# Altium schematic sheet ADC.SchDoc
size 297 x 209 mm
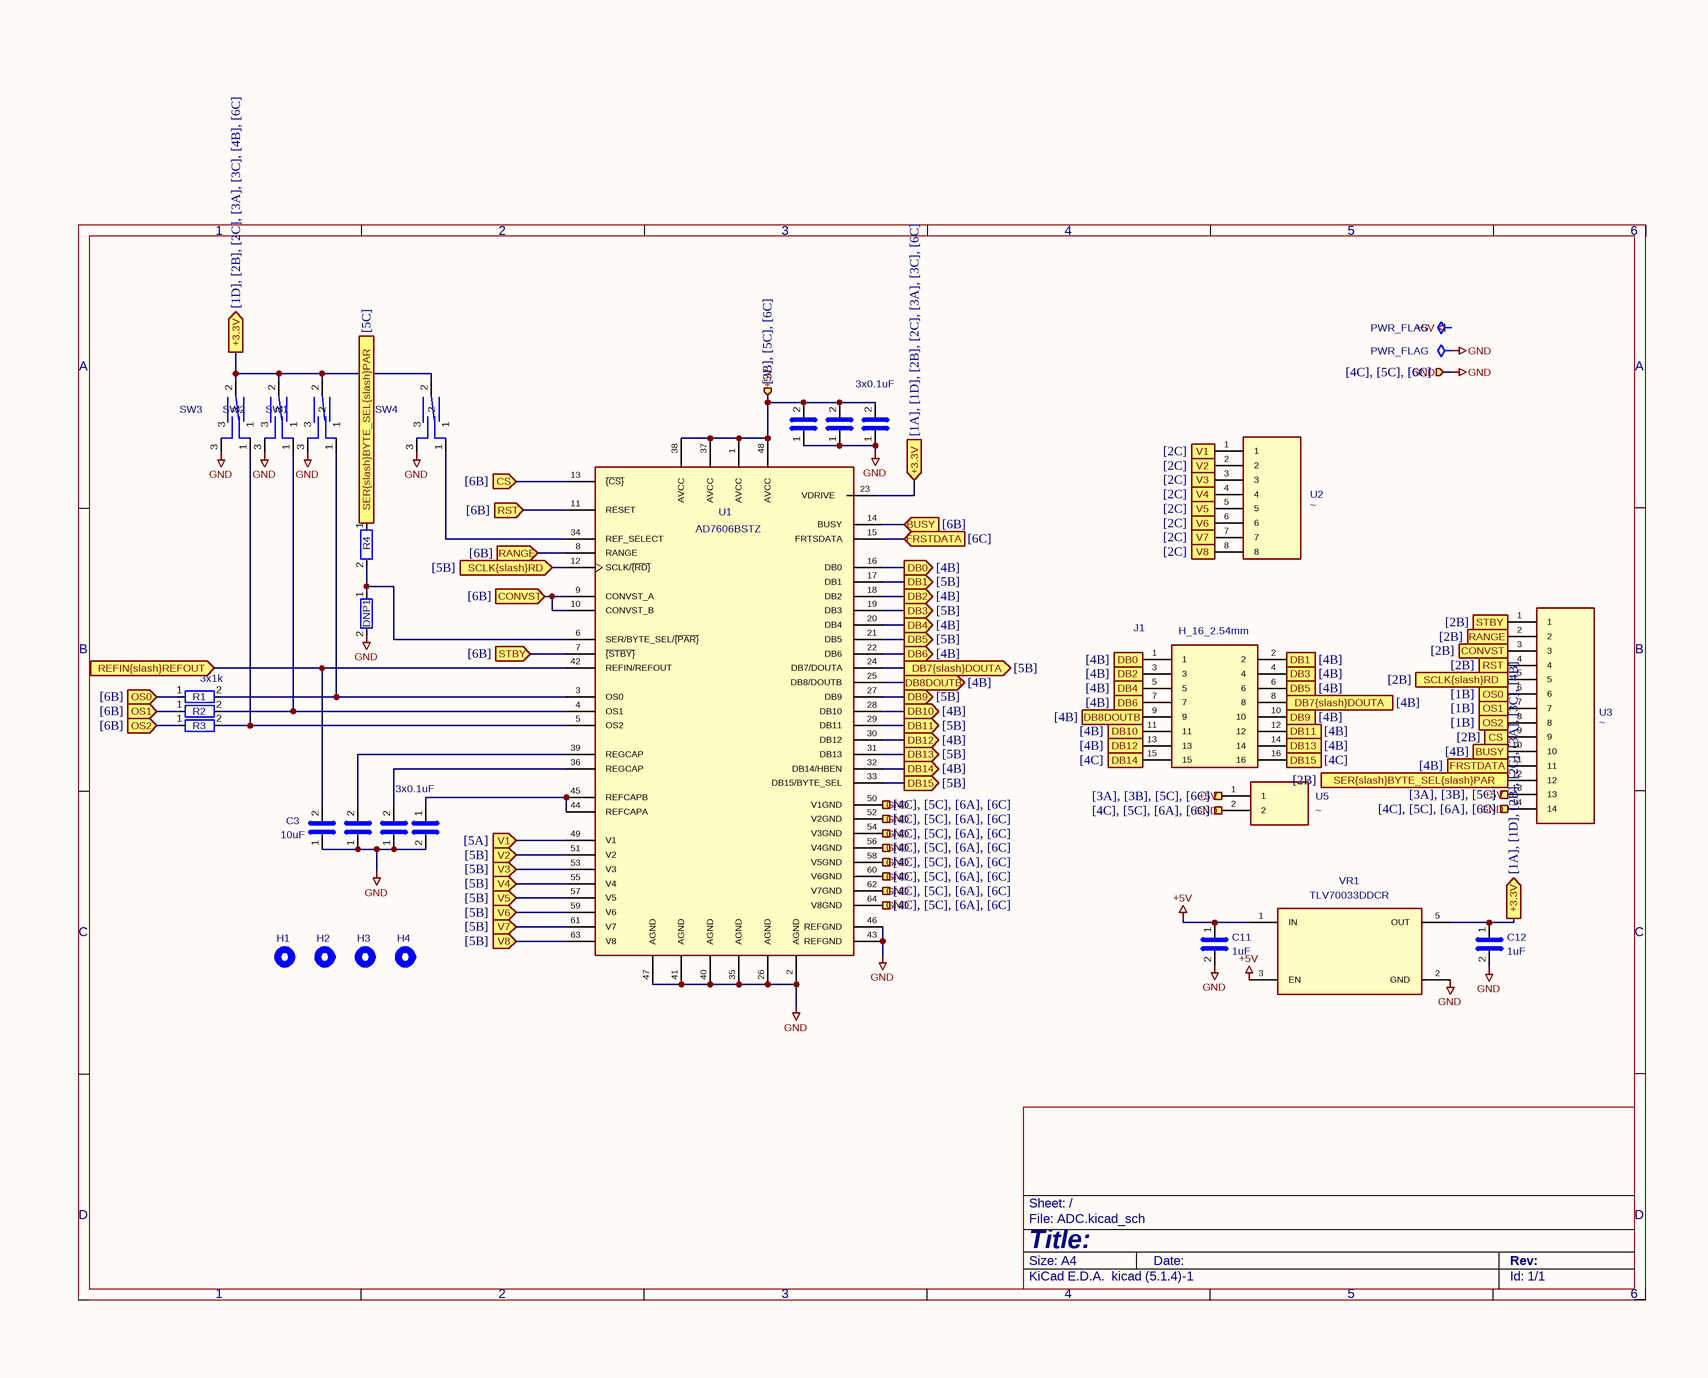
[diagram p0: ADC.SchDoc]

## Parts
#FLG02  PWR_FLAG  (graphical)
#FLG03  PWR_FLAG  (graphical)
C2  1uF  [C_0402_1005Metric_Pad0.74x0.62mm_HandSolder]  (value not drawn)
C3  10uF  [C_0805_2012Metric_Pad1.18x1.45mm_HandSolder]
C4  0.1uF  [C_0402_1005Metric_Pad0.74x0.62mm_HandSolder]  (value not drawn)
C6  1uF  [C_0402_1005Metric_Pad0.74x0.62mm_HandSolder]  (value not drawn)
C7  1uF  [C_0402_1005Metric_Pad0.74x0.62mm_HandSolder]  (value not drawn)
C8  0.1uF  [C_0402_1005Metric_Pad0.74x0.62mm_HandSolder]  (value not drawn)
C9  0.1uF  [C_0402_1005Metric_Pad0.74x0.62mm_HandSolder]  (value not drawn)
C11  1uF  [C_0402_1005Metric_Pad0.74x0.62mm_HandSolder]
C12  1uF  [C_0402_1005Metric_Pad0.74x0.62mm_HandSolder]
DNP1  10-47k  [R_0805_2012Metric_Pad1.20x1.40mm_HandSolder]  (value not drawn)
H1  MountingHole  [MountingHole_2.7mm_M2.5]  (value not drawn)
H2  MountingHole  [MountingHole_2.7mm_M2.5]  (value not drawn)
H3  MountingHole  [MountingHole_2.7mm_M2.5]  (value not drawn)
H4  MountingHole  [MountingHole_2.7mm_M2.5]  (value not drawn)
J1  H_16_2.54mm  [JST_SUR_SM16B-SURS-TF_1x16-1MP_P0.80mm_Horizontal]
R1  1k  [R_0402_1005Metric_Pad0.72x0.64mm_HandSolder]  (value not drawn)
R2  1k  [R_0402_1005Metric_Pad0.72x0.64mm_HandSolder]  (value not drawn)
R3  1k  [R_0402_1005Metric_Pad0.72x0.64mm_HandSolder]  (value not drawn)
R4  1k  [R_0805_2012Metric_Pad1.20x1.40mm_HandSolder]  (value not drawn)
SW1  SW_Reed_SPDT  [switch1]  (value not drawn)
SW2  SW_Reed_SPDT  [switch1]  (value not drawn)
SW3  SW_Reed_SPDT  [switch1]  (value not drawn)
SW4  SW_Reed_SPDT  [switch1]  (value not drawn)
U1  AD7606BSTZ  [AD7606BSTZ]
U2  ~  [JST_GH_SM08B-GHS-TB_1x08-1MP_P1.25mm_Horizontal]
U3  ~  [PinHeader_1x14_P2.54mm_Vertical]
U5  ~  [JST_GH_SM02B-GHS-TB_1x02-1MP_P1.25mm_Horizontal]
VR1  TLV70033DDCR  [TLV70033DDCR]

## Ports
+3.3V (in, see [1A], [1D], [2B], [2C], [3A], [3C], [6C]), +3.3V (out, see [1A], [1D], [2B], [2C], [3A], [3C], [4B]), +3.3V (out, see [1D], [2B], [2C], [3A], [3C], [4B], [6C]), +5V (in, see [3B], [5C], [6C]), +5V (out, see [3A], [3B], [5C]), +5V (out, see [3A], [3B], [5C], [6C]), BUSY (in, see [6B]), BUSY (out, see [4B]), CONVST (in, see [6B]), CONVST (out, see [2B]), CS (in, see [6B]), CS (out, see [2B]), DB0 (in, see [4B]), DB0 (out, see [4B]), DB1 (in, see [4B]), DB1 (out, see [5B]), DB2 (in, see [4B]), DB2 (out, see [4B]), DB3 (in, see [4B]), DB3 (out, see [5B]), DB4 (in, see [4B]), DB4 (out, see [4B]), DB5 (in, see [4B]), DB5 (out, see [5B]), DB6 (in, see [4B]), DB6 (out, see [4B]), DB7{slash}DOUTA (in, see [4B]), DB7{slash}DOUTA (out, see [5B]), DB8DOUTB (in, see [4B]), DB8DOUTB (out, see [4B]), DB9 (in, see [4B]), DB9 (out, see [5B]), DB10 (in, see [4B]), DB10 (out, see [4B]), DB11 (in, see [4B]), DB11 (out, see [5B]), DB12 (in, see [4B]), DB12 (out, see [4B]), DB13 (in, see [4B]), DB13 (out, see [5B]), DB14 (in, see [4C]), DB14 (out, see [4B]), DB15 (in, see [4C]), DB15 (out, see [5B]), FRSTDATA (in, see [6C]), FRSTDATA (out, see [4B]), GND (in, see [4C], [5C], [6A], [6C]), GND (in, see [4C], [5C], [6C]), GND (out, see [4C], [5C], [6A], [6C]), OS0 (in, see [6B]), OS0 (out, see [1B]), OS1 (in, see [6B]), OS1 (out, see [1B]), OS2 (in, see [6B]), OS2 (out, see [1B]), RANGE (in, see [6B]), RANGE (out, see [2B]), REFIN{slash}REFOUT (in), RST (in, see [6B]), RST (out, see [2B]), SCLK{slash}RD (in, see [5B]), SCLK{slash}RD (out, see [2B]), SER{slash}BYTE_SEL{slash}PAR (in, see [5C]), SER{slash}BYTE_SEL{slash}PAR (out, see [2B]), STBY (in, see [6B]), STBY (out, see [2B]), V1 (in, see [5A]), V1 (out, see [2C]), V2 (in, see [5B]), V2 (out, see [2C]), V3 (in, see [5B]), V3 (out, see [2C]), V4 (in, see [5B]), V4 (out, see [2C]), V5 (in, see [5B]), V5 (out, see [2C]), V6 (in, see [5B]), V6 (out, see [2C]), V7 (in, see [5B]), V7 (out, see [2C]), V8 (in, see [5B]), V8 (out, see [2C])

## Nets
+5V: #FLG03.1 C11.1 VR1.1(IN) VR1.3(EN)
GND: #FLG02.1 C2.1 C3.1 C4.1 C6.1 C7.2 C8.1 C9.1 C11.2 C12.2 DNP1.2 SW1.3 SW2.3 SW3.3 SW4.3 U1.2(AGND) U1.26(AGND) U1.35(AGND) U1.40(AGND) U1.41(AGND) U1.43(REFGND) U1.46(REFGND) U1.47(AGND) U1.50(V1GND) U1.52(V2GND) U1.54(V3GND) U1.56(V4GND) U1.58(V5GND) U1.60(V6GND) U1.62(V7GND) U1.64(V8GND) U3.14 U5.2 VR1.2(GND) ; port GND
+3.3V: C12.1 SW1.2 SW2.2 SW3.2 SW4.2 U1.23(VDRIVE) VR1.5(OUT) ; port +3.3V
+5V: C4.2 C8.2 C9.2 U1.1(AVCC) U1.37(AVCC) U1.38(AVCC) U1.48(AVCC) U3.13 U5.1 ; port +5V  [a separate net that carries the same name]
BUSY: U1.14(BUSY) U3.10 ; port BUSY
CONVST: U1.9(CONVST_A) U1.10(CONVST_B) U3.3 ; port CONVST
CS: U1.13(~{{CS}}) U3.9 ; port CS
DB0: J1.1 U1.16(DB0) ; port DB0
DB1: J1.2 U1.17(DB1) ; port DB1
DB2: J1.3 U1.18(DB2) ; port DB2
DB3: J1.4 U1.19(DB3) ; port DB3
DB4: J1.5 U1.20(DB4) ; port DB4
DB5: J1.6 U1.21(DB5) ; port DB5
DB6: J1.7 U1.22(DB6) ; port DB6
DB7{slash}DOUTA: J1.8 U1.24(DB7/DOUTA) ; port DB7{slash}DOUTA
DB8DOUTB: J1.9 U1.25(DB8/DOUTB) ; port DB8DOUTB
DB9: J1.10 U1.27(DB9) ; port DB9
DB10: J1.11 U1.28(DB10) ; port DB10
DB11: J1.12 U1.29(DB11) ; port DB11
DB12: J1.13 U1.30(DB12) ; port DB12
DB13: J1.14 U1.31(DB13) ; port DB13
DB14: J1.15 U1.32(DB14/HBEN) ; port DB14
DB15: J1.16 U1.33(DB15/BYTE_SEL) ; port DB15
FRSTDATA: U1.15(FRTSDATA) U3.11 ; port FRSTDATA
OS0: R1.1 U3.6 ; port OS0
OS1: R2.1 U3.7 ; port OS1
OS2: R3.1 U3.8 ; port OS2
RANGE: U1.8(RANGE) U3.2 ; port RANGE
REFIN{slash}REFOUT: C3.2 U1.42(REFIN/REFOUT) ; port REFIN{slash}REFOUT
RST: U1.11(RESET) U3.4 ; port RST
SCLK{slash}RD: U1.12(SCLK/~{{RD}}) U3.5 ; port SCLK{slash}RD
SER{slash}BYTE_SEL{slash}PAR: R4.1 U3.12 ; port SER{slash}BYTE_SEL{slash}PAR
STBY: U1.7(~{{STBY}}) U3.1 ; port STBY
V1: U1.49(V1) U2.1 ; port V1
V2: U1.51(V2) U2.2 ; port V2
V3: U1.53(V3) U2.3 ; port V3
V4: U1.55(V4) U2.4 ; port V4
V5: U1.57(V5) U2.5 ; port V5
V6: U1.59(V6) U2.6 ; port V6
V7: U1.61(V7) U2.7 ; port V7
V8: U1.63(V8) U2.8 ; port V8
NetC2_2: C2.2 U1.36(REGCAP)
NetC6_2: C6.2 U1.39(REGCAP)
NetC7_1: C7.1 U1.44(REFCAPA) U1.45(REFCAPB)
NetDNP1_1: DNP1.1 R4.2 U1.6(SER/BYTE_SEL/~{{PAR}})
NetR1_2: R1.2 SW1.1 U1.3(OS0)
NetR2_2: R2.2 SW2.1 U1.4(OS1)
NetR3_2: R3.2 SW3.1 U1.5(OS2)
NetSW4_1: SW4.1 U1.34(REF_SELECT)

## Notes on the sheet
- 3x0.1uF
- (near R1) 3x1k
- 1
- 2
- 3
- 4
- 5
- 6
- A
- B
- C
- D
- Title:
- File: ADC.kicad_sch
- Sheet: /
- KiCad E.D.A.  kicad (5.1.4)-1
- Size: A4
- Date:
- Rev:
- Id: 1/1

## Library data of the parts
#FLG02 #FLG03 = PWR_FLAG: Description: Special symbol for telling ERC where power comes from; Value: PWR_FLAG
C2-C4 C6-C9 C11 C12 = C: Description: Unpolarized capacitor
  C2 C6 C7 C11 C12: website: https://eu.mouser.com/ProductDetail/Murata-Electronics/GRM155Z71A105KE01D?qs=%252B6g0mu59x7LZ5VDL%2FTet%2Fg%3D%3D; Value: 1uF; Footprint: Capacitor_SMD:C_0402_1005Metric_Pad0.74x0.62mm_HandSolder
  C3: website: https://www.mouser.bg/ProductDetail/Murata-Electronics/GRM21BZ71E106KE15L?qs=Ey7%2FXF42M3fdXe9bIpCO9w%3D%3D; Value: 10uF; Footprint: Capacitor_SMD:C_0805_2012Metric_Pad1.18x1.45mm_HandSolder
  C4 C8 C9: website: https://www.mouser.bg/ProductDetail/Murata-Electronics/GRM155R71H104KE14D?qs=2UZY3JfgLCy9gG9icKV9Yg%3D%3D; Value: 0.1uF; Footprint: Capacitor_SMD:C_0402_1005Metric_Pad0.74x0.62mm_HandSolder
DNP1 R1-R4 = R: Description: Resistor
  DNP1: Value: 10-47k; Footprint: Resistor_SMD:R_0805_2012Metric_Pad1.20x1.40mm_HandSolder
  R1-R3: website: https://www.digikey.bg/en/products/detail/yageo/RC0805FR-071KL/727444; Value: 1k; Footprint: Resistor_SMD:R_0402_1005Metric_Pad0.72x0.64mm_HandSolder
  R4: website: https://www.digikey.bg/en/products/detail/yageo/RC0805FR-071KL/727444; Value: 1k; Footprint: Resistor_SMD:R_0805_2012Metric_Pad1.20x1.40mm_HandSolder
H1-H4 = MountingHole: Description: Mounting Hole without connection; Value: MountingHole; Footprint: MountingHole:MountingHole_2.7mm_M2.5
J1 = MTSW-150-22-S-D-415: MF: Samtec; Description_1: \n                        \n                            MTSW - Samtec 2.54mm Variable Post Height Header  22 Lead Style\n                        \n; Package: None; Price: None; Check_prices: https://www.snapeda.com/parts/MTSW-150-22-S-D-415/Samtec/view-part/?ref=eda; STANDARD: Manufacturer Recommendations; PARTREV: R; SnapEDA_Link: https://www.snapeda.com/parts/MTSW-150-22-S-D-415/Samtec/view-part/?ref=snap; MP: MTSW-150-22-S-D-415; Availability: In Stock; MANUFACTURER: Samtec; Value: H_16_2.54mm; Footprint: Connector_JST:JST_SUR_SM16B-SURS-TF_1x16-1MP_P0.80mm_Horizontal
SW1-SW4 = SW_Reed_SPDT: Description: SPDT reed switch; website: https://www.digikey.bg/en/products/detail/e-switch/500SSP1S1M2REA/378941; Value: SW_Reed_SPDT; Footprint: Switches:switch1
U1 = AD7606BSTZ: MANUFACTURER: Analog Devices Inc.; MF: Analog Devices; SNAPEDA_PACKAGE_ID: 6381; Description_1: \n                        \n                            8-Channel DAS with 16-Bit, Bipolar Input, Simultaneous Sampling ADC\n                        \n; Package: LQFP -64 Analog Devices; Price: None; Check_prices: https://www.snapeda.com/parts/AD7606BSTZ/Analog+Devices/view-part/?ref=eda; SnapEDA_Link: https://www.snapeda.com/parts/AD7606BSTZ/Analog+Devices/view-part/?ref=snap; MP: AD7606BSTZ; Availability: In Stock; Value: AD7606BSTZ; Footprint: ADC:AD7606BSTZ; Supplier 1: Arrow Electronics; Supplier Part Number 1: AD7606BSTZ
U2 = H_8: Value: ~; Footprint: Connector_JST:JST_GH_SM08B-GHS-TB_1x08-1MP_P1.25mm_Horizontal
U3 = H_14: Value: ~; Footprint: Connector_PinHeader_2.54mm:PinHeader_1x14_P2.54mm_Vertical
U5 = H_2: Value: ~; Footprint: Connector_JST:JST_GH_SM02B-GHS-TB_1x02-1MP_P1.25mm_Horizontal
VR1 = TLV70033DDCR: MF: Texas Instruments; Description_1: \n                        \n                            200-mA, high-PSRR, low-IQ, low-dropout voltage regulator with enable\n                        \n; Package: SOT-23-THN-5 Texas Instruments; Price: None; SnapEDA_Link: https://www.snapeda.com/parts/TLV70033DDCR/Texas+Instruments/view-part/?ref=snap; MP: TLV70033DDCR; Availability: In Stock; Check_prices: https://www.snapeda.com/parts/TLV70033DDCR/Texas+Instruments/view-part/?ref=eda; Value: TLV70033DDCR; Footprint: LDOs:TLV70033DDCR